# Altium project PUA.PrjPcb (part 13 of 14)

## Sheet Server_CPU_Sub_Power_Supplies.SchDoc
size D
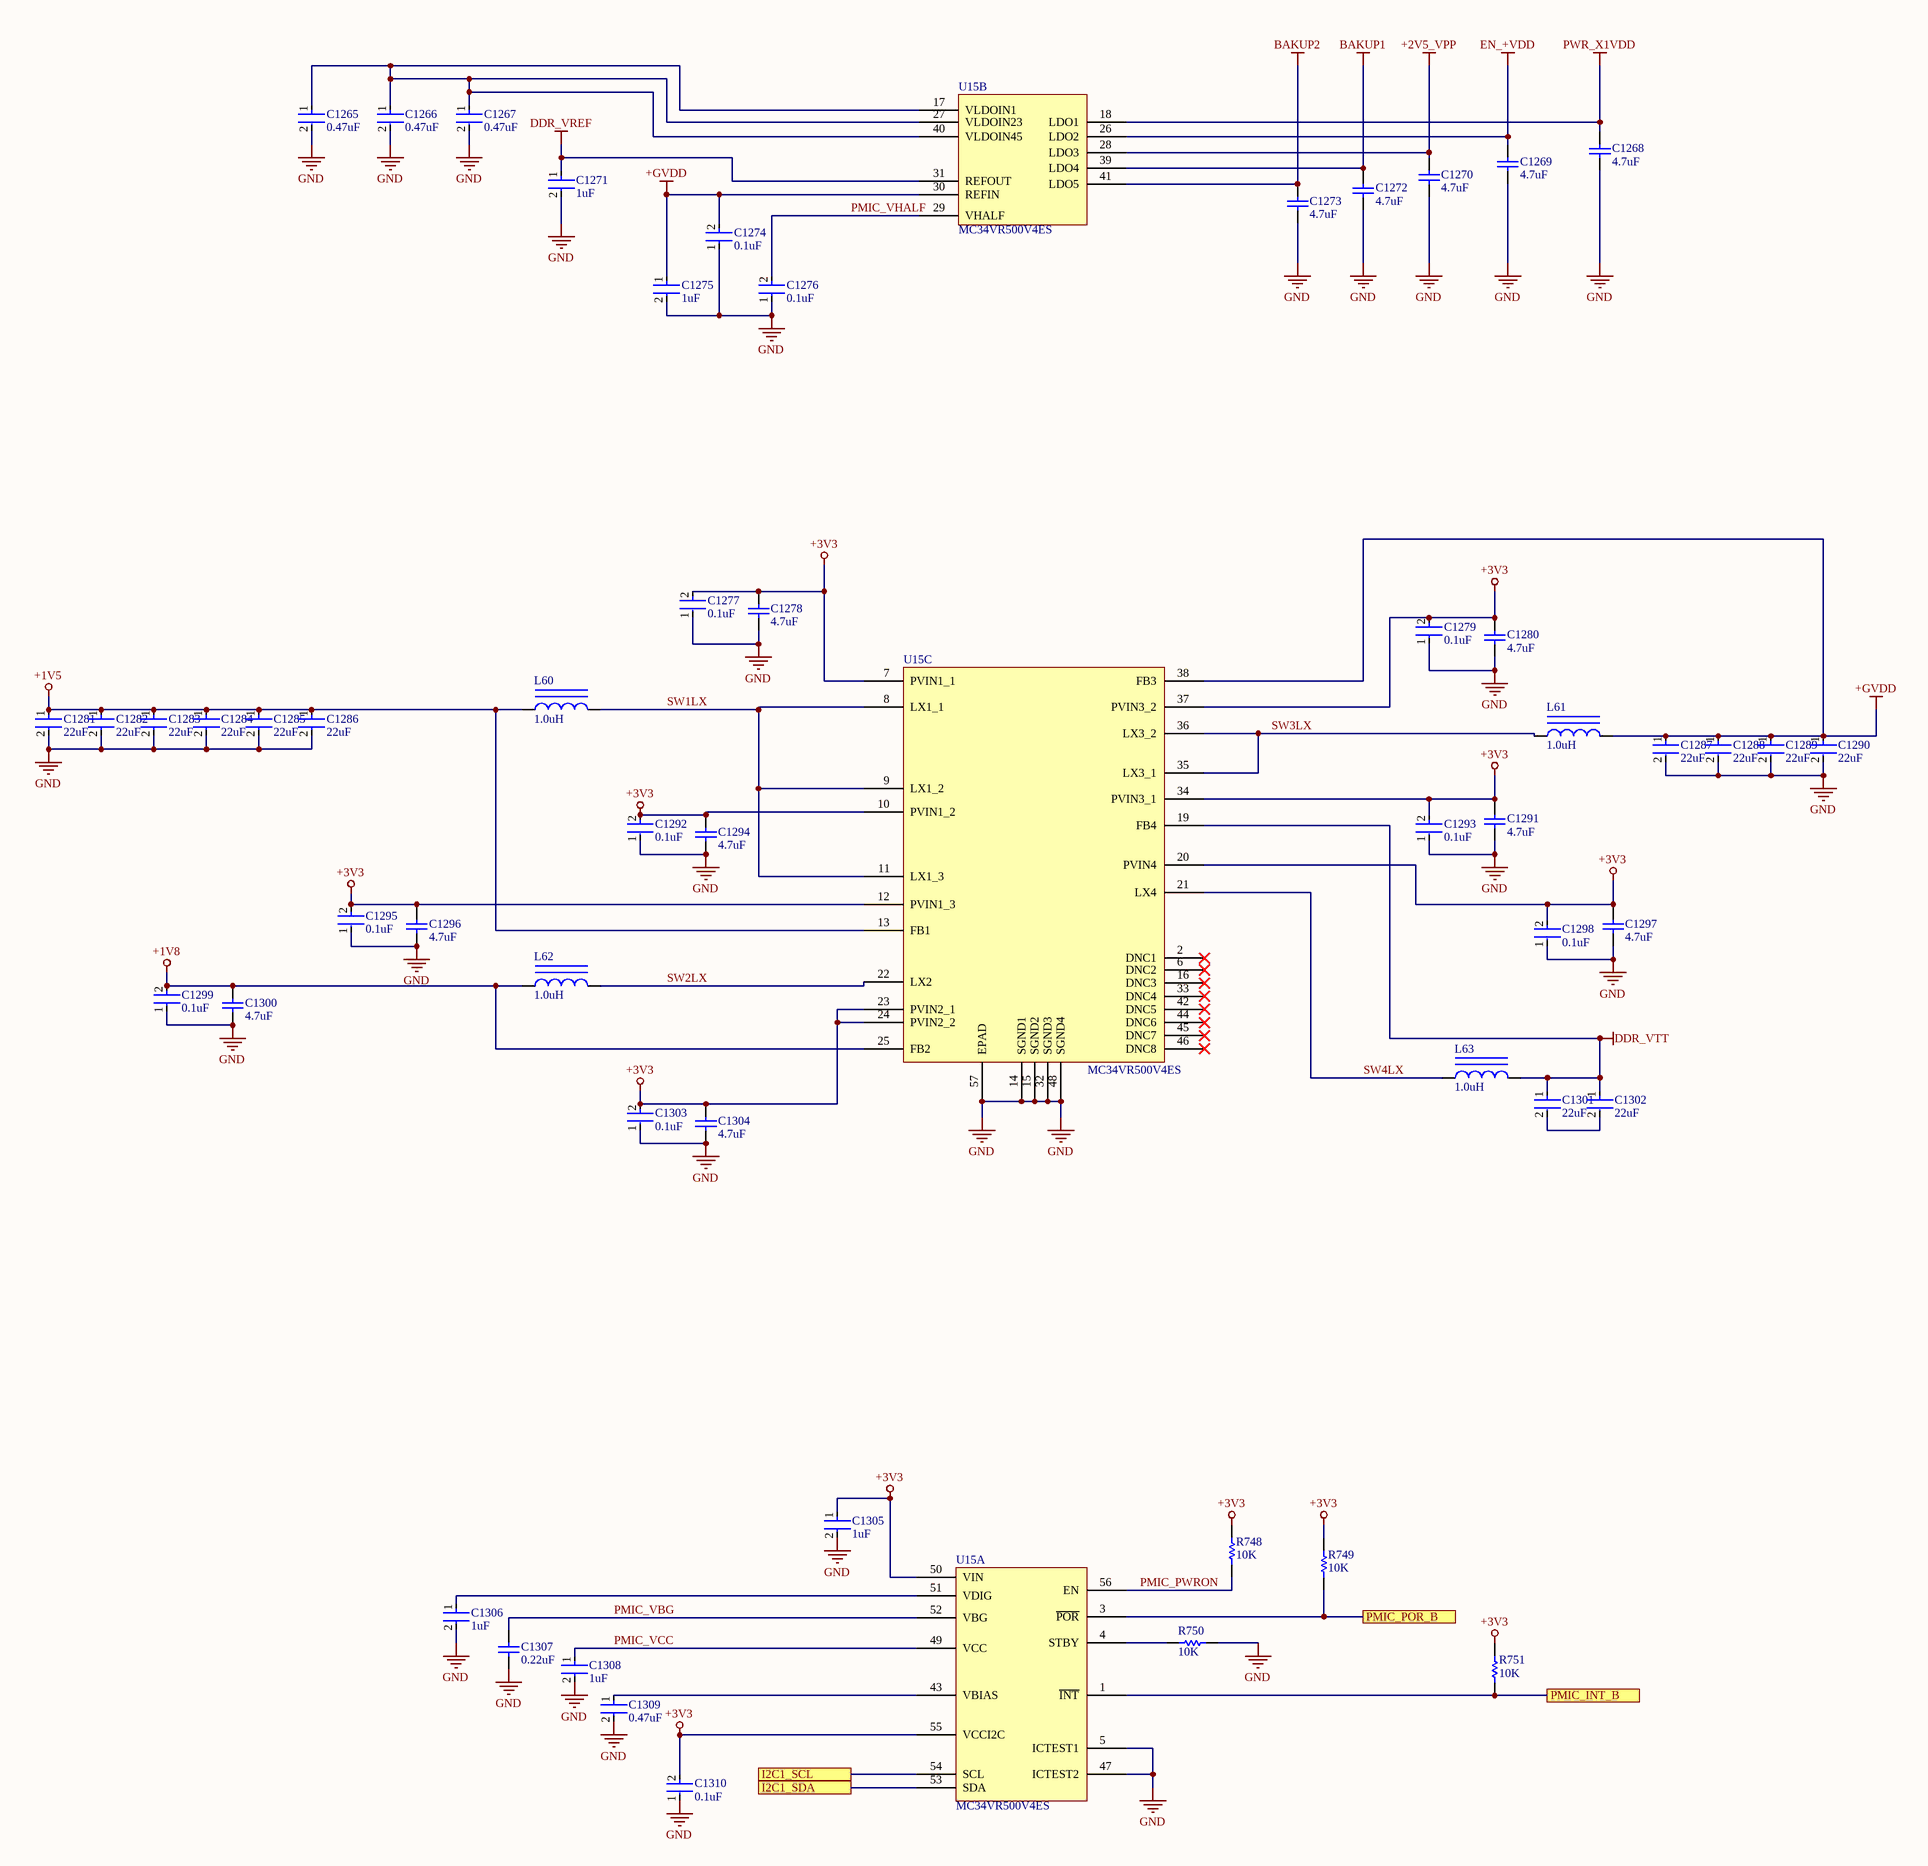
[diagram p64: Server_CPU_Sub_Power_Supplies.SchDoc]

### Parts
C1265  0.47uF  [FP-GRM188-0_1-e0_2_0_5-IPC_B]
C1266  0.47uF  [FP-GRM188-0_1-e0_2_0_5-IPC_B]
C1267  0.47uF  [FP-GRM188-0_1-e0_2_0_5-IPC_B]
C1268  4.7uF  [CAPC2013X145X50ML20T25]
C1269  4.7uF  [CAPC2013X145X50ML20T25]
C1270  4.7uF  [CAPC2013X145X50ML20T25]
C1271  1uF  [FP-GRM15-0_1-MFG]
C1272  4.7uF  [CAPC2013X145X50ML20T25]
C1273  4.7uF  [CAPC2013X145X50ML20T25]
C1274  0.1uF  [FP-GRM15-MFG]
C1275  1uF  [FP-GRM15-0_1-MFG]
C1276  0.1uF  [FP-GRM15-MFG]
C1277  0.1uF  [FP-GRM15-MFG]
C1278  4.7uF  [CAPC2013X145X50ML20T25]
C1279  0.1uF  [FP-GRM15-MFG]
C1280  4.7uF  [CAPC2013X145X50ML20T25]
C1281  22uF  [FP-GRM21B-0_15-MFG]
C1282  22uF  [FP-GRM21B-0_15-MFG]
C1283  22uF  [FP-GRM21B-0_15-MFG]
C1284  22uF  [FP-GRM21B-0_15-MFG]
C1285  22uF  [FP-GRM21B-0_15-MFG]
C1286  22uF  [FP-GRM21B-0_15-MFG]
C1287  22uF  [FP-GRM21B-0_15-MFG]
C1288  22uF  [FP-GRM21B-0_15-MFG]
C1289  22uF  [FP-GRM21B-0_15-MFG]
C1290  22uF  [FP-GRM21B-0_15-MFG]
C1291  4.7uF  [CAPC2013X145X50ML20T25]
C1292  0.1uF  [FP-GRM15-MFG]
C1293  0.1uF  [FP-GRM15-MFG]
C1294  4.7uF  [CAPC2013X145X50ML20T25]
C1295  0.1uF  [FP-GRM15-MFG]
C1296  4.7uF  [CAPC2013X145X50ML20T25]
C1297  4.7uF  [CAPC2013X145X50ML20T25]
C1298  0.1uF  [FP-GRM15-MFG]
C1299  0.1uF  [FP-GRM15-MFG]
C1300  4.7uF  [CAPC2013X145X50ML20T25]
C1301  22uF  [FP-GRM21B-0_15-MFG]
C1302  22uF  [FP-GRM21B-0_15-MFG]
C1303  0.1uF  [FP-GRM15-MFG]
C1304  4.7uF  [CAPC2013X145X50ML20T25]
C1305  1uF  [FP-GRM15-0_1-MFG]
C1306  1uF  [FP-GRM15-0_1-MFG]
C1307  0.22uF  [CAPC1005X55X25NL05T10]
C1308  1uF  [FP-GRM15-0_1-MFG]
C1309  0.47uF  [FP-GRM188-0_1-e0_2_0_5-IPC_B]
C1310  0.1uF  [FP-GRM15-MFG]
L60  1.0uH  [BOUR-CM45_L]
L61  1.0uH  [BOUR-CM45_L]
L62  1.0uH  [BOUR-CM45_L]
L63  1.0uH  [BOUR-CM45_L]
R748  10K  [RESC1005X40X25LL05T05]
R749  10K  [RESC1005X40X25LL05T05]
R750  10K  [RESC1005X40X25LL05T05]
R751  10K  [RESC1005X40X25LL05T05]
U15  MC34VR500V4ES  [QFN50P800X800X90-57N]  (parts A,B,C of 3)

### Ports
I2C1_SCL, I2C1_SDA, PMIC_INT_B, PMIC_POR_B

### Nets
+1V5: C1281.1 C1282.1 C1283.1 C1284.1 C1285.1 C1286.1 L60.1 U15.13(FB1)
+1V8: C1299.2 C1300.2 L62.1 U15.25(FB2)
+2V5_VPP: C1270.2 U15.28(LDO3)
+3V3: C1277.2 C1278.2 C1279.2 C1280.2 C1291.2 C1292.2 C1293.2 C1294.2 C1295.2 C1296.2 C1297.2 C1298.2 C1303.2 C1304.2 C1305.1 C1310.2 R748.2 R749.2 R751.2 U15.7(PVIN1_1) U15.10(PVIN1_2) U15.12(PVIN1_3) U15.20(PVIN4) U15.23(PVIN2_1) U15.24(PVIN2_2) U15.34(PVIN3_1) U15.37(PVIN3_2) U15.50(VIN) U15.55(VCCI2C)
+GVDD: C1274.2 C1275.1 C1287.1 C1288.1 C1289.1 C1290.1 L61.2 U15.30(REFIN) U15.38(FB3)
BAKUP1: C1272.2 U15.39(LDO4)
BAKUP2: C1273.2 U15.41(LDO5)
DDR_VREF: C1271.1 U15.31(REFOUT)
DDR_VTT: C1301.1 C1302.1 L63.2 U15.19(FB4)
EN_+VDD: C1269.2 U15.26(LDO2)
GND: C1265.2 C1266.2 C1267.2 C1268.1 C1269.1 C1270.1 C1271.2 C1272.1 C1273.1 C1274.1 C1275.2 C1276.1 C1277.1 C1278.1 C1279.1 C1280.1 C1281.2 C1282.2 C1283.2 C1284.2 C1285.2 C1286.2 C1287.2 C1288.2 C1289.2 C1290.2 C1291.1 C1292.1 C1293.1 C1294.1 C1295.1 C1296.1 C1297.1 C1298.1 C1299.1 C1300.1 C1303.1 C1304.1 C1305.2 C1306.2 C1307.1 C1308.2 C1309.2 C1310.1 R750.1 U15.5(ICTEST1) U15.14(SGND1) U15.15(SGND2) U15.32(SGND3) U15.47(ICTEST2) U15.48(SGND4) U15.57(EPAD)
PWR_X1VDD: C1268.2 U15.18(LDO1)
PMIC_PWRON: R748.1 U15.56(EN)
PMIC_VBG: C1307.2 U15.52(VBG)
PMIC_VCC: C1308.1 U15.49(VCC)
PMIC_VHALF: C1276.2 U15.29(VHALF)
SW1LX: L60.2 U15.8(LX1_1) U15.9(LX1_2) U15.11(LX1_3)
SW2LX: L62.2 U15.22(LX2)
SW3LX: L61.1 U15.35(LX3_1) U15.36(LX3_2)
SW4LX: L63.1 U15.21(LX4)
NetC1265_1: C1265.1 C1266.1 C1267.1 U15.17(VLDOIN1) U15.27(VLDOIN23) U15.40(VLDOIN45)
NetC1301_2: C1301.2 C1302.2
NetC1306_1: C1306.1 U15.51(VDIG)
NetC1309_1: C1309.1 U15.43(VBIAS)
NetR749_1: R749.1 U15.3(~{POR}) ; port PMIC_POR_B
NetR750_2: R750.2 U15.4(STBY)
NetR751_1: R751.1 U15.1(~{INT}) ; port PMIC_INT_B
NetU15_53: U15.53(SDA) ; port I2C1_SDA
NetU15_54: U15.54(SCL) ; port I2C1_SCL

Not connected (* = marked no-connect by the designer): U15 2(DNC1)* 6(DNC2)* 16(DNC3)* 33(DNC4)* 42(DNC5)* 44(DNC6)* 45(DNC7)* 46(DNC8)*

### Notes on the sheet
- Title
- Size:
- Date:
- File:
- D
- Number:
- Time:
- Revision:
- Sheet
- of

### Library data of the parts
C1265-C1267 C1309 = CMP-2006-02860-2: Chip Multilayer Ceramic Capacitors for General Purpose, 0603, 0.47uF, X7R, 15%, 10%, 16V; Capacitance: 470nF; Material: Ceramic; Termination: SMD/SMT; Case Code (Imperial): 0603; Height: 0.8mm; Dielectric: X7R; Length: 1.6mm; Packaging: Tape and Reel; Mount: Surface Mount; Thickness: 0.035inch; Voltage Rating (DC): 16V; Case Code (Metric): 1608; REACH SVHC: No SVHC; Depth: 0.8mm; Number of Pins: 2; Max Operating Temperature: 125°C; Min Operating Temperature: -55°C; Width: 0.8mm; Voltage: 16V; Lead Free: Lead Free; Voltage Rating: 16V; Package Quantity: 1; Case/Package: 0603; Tolerance: 10%
C1268-C1270 C1272 C1273 C1278 C1280 C1291 C1294 C1296 C1297 C1300 C1304 = CMP-2007-01010-1: Manufacturer: Kemet; Part Number: C0805C475K3PACTU
C1271 C1275 C1305 C1306 C1308 = CMP-2008-04556-2: CAP CER 1UF 10V X5R 0402; Manufacturer Part Number: GRM155R61A105KE15D; Manufacturer: Murata; Material: Ceramic; Tolerance: 10%; Temperature Coefficient: 15%; Octopart: https://octopart.com/grm155r61a105ke15d-murata-197442; Lead Free: Yes; ComponentLink2Description: Datasheet; Temperature: -55°C to +85°C; Temperature Range High: +85°C; Height: 0.55mm; Capacitance: 1uF; Ipc Land Pattern Name: CAPC10050X50; ComponentLink2URL: https://search.murata.co.jp/Ceramy/image/img/A01X/G101/ENG/GRM155R61A105KE15-01A.pdf; Temperature Range Low: -55°C; Device Class L2: Capacitors; Voltage Rating: 10V; RoHS: TRUE; Device Class L1: Passive Components; Device Class L3: Ceramic Capacitors; Temperature Characteristic: X5R; Mouser Description: 0402 1 uF 10 V ±10% Tolerance X5R Surface Mount Multilayer Ceramic Capacitor; Automotive: No; Package: GRM15-0.1; Digikey Description: CAP CER 1UF 10V X5R 0402; Value: 1uF; Category: Cap
C1274 C1276 C1277 C1279 C1292 C1293 C1295 C1298 C1299 C1303 C1310 = CMP-2100-03641-2: CAP CER 0.1UF 16V X7R 0402; Manufacturer Part Number: GRM155R71C104KA88D; Manufacturer: Murata; Standoff Height: 0mm; Tolerance: 10%; Voltage Rating: 16Vdc; Material: Ceramic; Capacitance: 0.10μF; Value: 0.10μF; RoHS: TRUE; Temperature Characteristic: X7R; Octopart: https://octopart.com/grm155r71c104ka88d-murata-196880; Digikey Description: CAP CER 0.1UF 16V X7R 0402; Device Class L3: Ceramic Capacitors; Height: 0.55mm; ComponentLink2Description: Datasheet; Temperature Range Low: -55°C; Ipc Land Pattern Name: CAPC10050X219; ComponentLink2URL: https://search.murata.co.jp/Ceramy/image/img/A01X/G101/ENG/GRM155R71H471KA01-01A.pdf; Device Class L1: Passive Components; Lead Free: yes; Category: Cap; Package: GRM15; Temperature: -55°C to +125°C; Device Class L2: Capacitors; Temperature Range High: +125°C; Mouser Description: 0402 0.1 uF 16V ±10 % Tolerance X7R SMT Multilayer Ceramic Capacitor
C1281-C1290 C1301 C1302 = CMP-2007-03385-2: Chip Multilayer Ceramic Capacitors for General Purpose, 0805, 22uF, X5R, 15%, 20%, 6.3V; Material: Ceramic; Max Operating Temperature: 85°C; Voltage: 6.3V; Min Operating Temperature: -55°C; Case/Package: 0805; Thickness: 0.053inch; Dielectric: X5R; Packaging: Tape and Reel; Depth: 1.25mm; Termination: SMD/SMT; Voltage Rating (DC): 6.3V; Radiation Hardening: No; Tolerance: 20%; Mount: Surface Mount; Lead Free: Lead Free; Package Quantity: 1; REACH SVHC: No SVHC; Voltage Rating: 6.3V; Capacitance: 22uF; Length: 2mm; Case Code (Imperial): 0805; Case Code (Metric): 2012; Width: 0.049inch; Height: 1.25mm
C1307 = CMP-2008-04561-4: Chip Capacitor, 220 nF, +/- 10%, 10 V, -55 to 85 degC, 0402 (1005 Metric), RoHS, Tape and Reel; Manufacturer: Basic Passives; PartNumber: GRM155R61A224KE19D; Case\/Package: 0402; Voltage Rating: 10 V; Type (Capacitors): X5R; Capacitance: 220 nF; Max Operating Temperature: 85 degC; Package Quantity: 1; RoHSCompliant: true; Height: 0.5 mm; Mounting Technology: Surface Mount; Case Code (Metric): 1005; ComponentLink2URL: http://search.murata.co.jp/Ceramy/image/img/A01X/G101/ENG/GRM155R61A224KE19-01.pdf; Case Code (Imperial): 0402; Length: 1 mm; Radiation Hardening: No; Tolerance: 10%; Pins: 2; ComponentLink1Description: Manufacturer URL; Voltage Rating (DC): 10 V; Width: 0.5 mm; REACH SVHC: No SVHC; ComponentLink1URL: http://www.murata.com/; Min Operating Temperature: -55 degC; DatasheetVersion: 03/2016; Mount: Surface Mount; PackageReference: 0402; Packaging: Tape and Reel; ComponentLink2Description: Datasheet; PackageDescription: 2-Pin Surface Mount Device, Body 1 x 0.5 mm
L60-L63 = CMP-2000-06114-1: Chip Inductor, 1 uH, +/- 10%, 450 mA, -40 to 125 degC, 2-Pin SMD (1812), RoHS, Tape and Reel; Manufacturer: Bourns; Nominal inductivity: 1µH; Content: 1pc(s); Nominal current: 0.45A; Type: CM453232-1R0KL; Category: Inductor; Package Description: 2-Pin Surface Mount Device, Body 4.5 x 3.2 mm; Manufacturer URL: http://www.bourns.com/; LN: 1µH; Package Reference: CM45; Mounting Technology: SurfaceMount; Datasheet URL: http://www.bourns.com/docs/Product-Datasheets/cm.pdf; Datasheet Version: 03/2016
R748-R751 = CMP-2000-07588-1: Chip Resistor, 10 KOhm, +/- 1%, 0.1 W, -55 to 155 degC, 0402 (1005 Metric), RoHS, Tape and Reel; Manufacturer: Panasonic; Power Rating: 100mW; Voltage Rating: 50V; Resistance: 10KOhm; Case\/Package: 0402; Temperature Coefficient: 100ppm\/degreesC; RoHSCompliant: True; Lead Free: LeadFree; Package Quantity: 1; Contact Plating: Tin; Length: 1mm; Radiation Hardening: No; REACH SVHC: NoSVHC; Max Operating Temperature: 155degC; Depth: 0.5mm; Case Code (Imperial): 0402; Military Standard: Not; Package Description: 2-Pin Surface Mount Device, Body 1 x 0.5 mm; Termination: SMD/SMT; Case Code (Metric): 1005; Height: 0.35mm; Packaging: TapeandReel; Voltage Rating (DC): 50V; Package Reference: 402; Number of Pins: 2; Tolerance: 1%; Mounting Technology: SurfaceMount; Width: 0.02inch; Mount: SurfaceMount; Datasheet URL: https://industrial.panasonic.com/cdbs/www-data/pdf/RDA0000/AOA0000C304.pdf; Composition: ThickFilm; Datasheet Version: 02/2017; Manufacturer URL: http://www.panasonic.com/; Max Power Dissipation: 100mW; Number of Terminations: 2; Min Operating Temperature: -55degC
U15 = MC34VR500V4ES: Regulator, Buck, Quad with up to 4.5A Output and Triple User-programmable LDOs, QFN 56, Tray; MF: {'manufacturer': u'NXP Semiconductors'}; Package: None; MP: MC34VR500V4ES; Value: *; Availability: Unavailable; Price: None

## Sheet SGMII_CONNECTION.SchDoc
size A
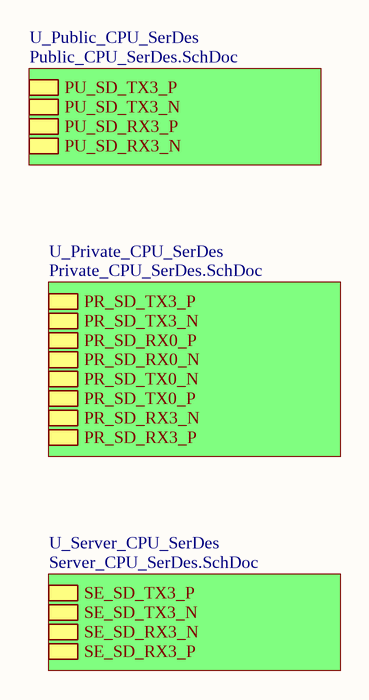
[diagram p65: SGMII_CONNECTION.SchDoc]

### Sub-sheets
U_Private_CPU_SerDes = Private_CPU_SerDes.SchDoc: PR_SD_TX3_P, PR_SD_TX3_N, PR_SD_RX0_P, PR_SD_RX0_N, PR_SD_TX0_N, PR_SD_TX0_P, PR_SD_RX3_N, PR_SD_RX3_P
U_Public_CPU_SerDes = Public_CPU_SerDes.SchDoc: PU_SD_TX3_P, PU_SD_TX3_N, PU_SD_RX3_P, PU_SD_RX3_N
U_Server_CPU_SerDes = Server_CPU_SerDes.SchDoc: SE_SD_TX3_P, SE_SD_TX3_N, SE_SD_RX3_N, SE_SD_RX3_P

## Sheet Public_CPU_SerDes.SchDoc
size D
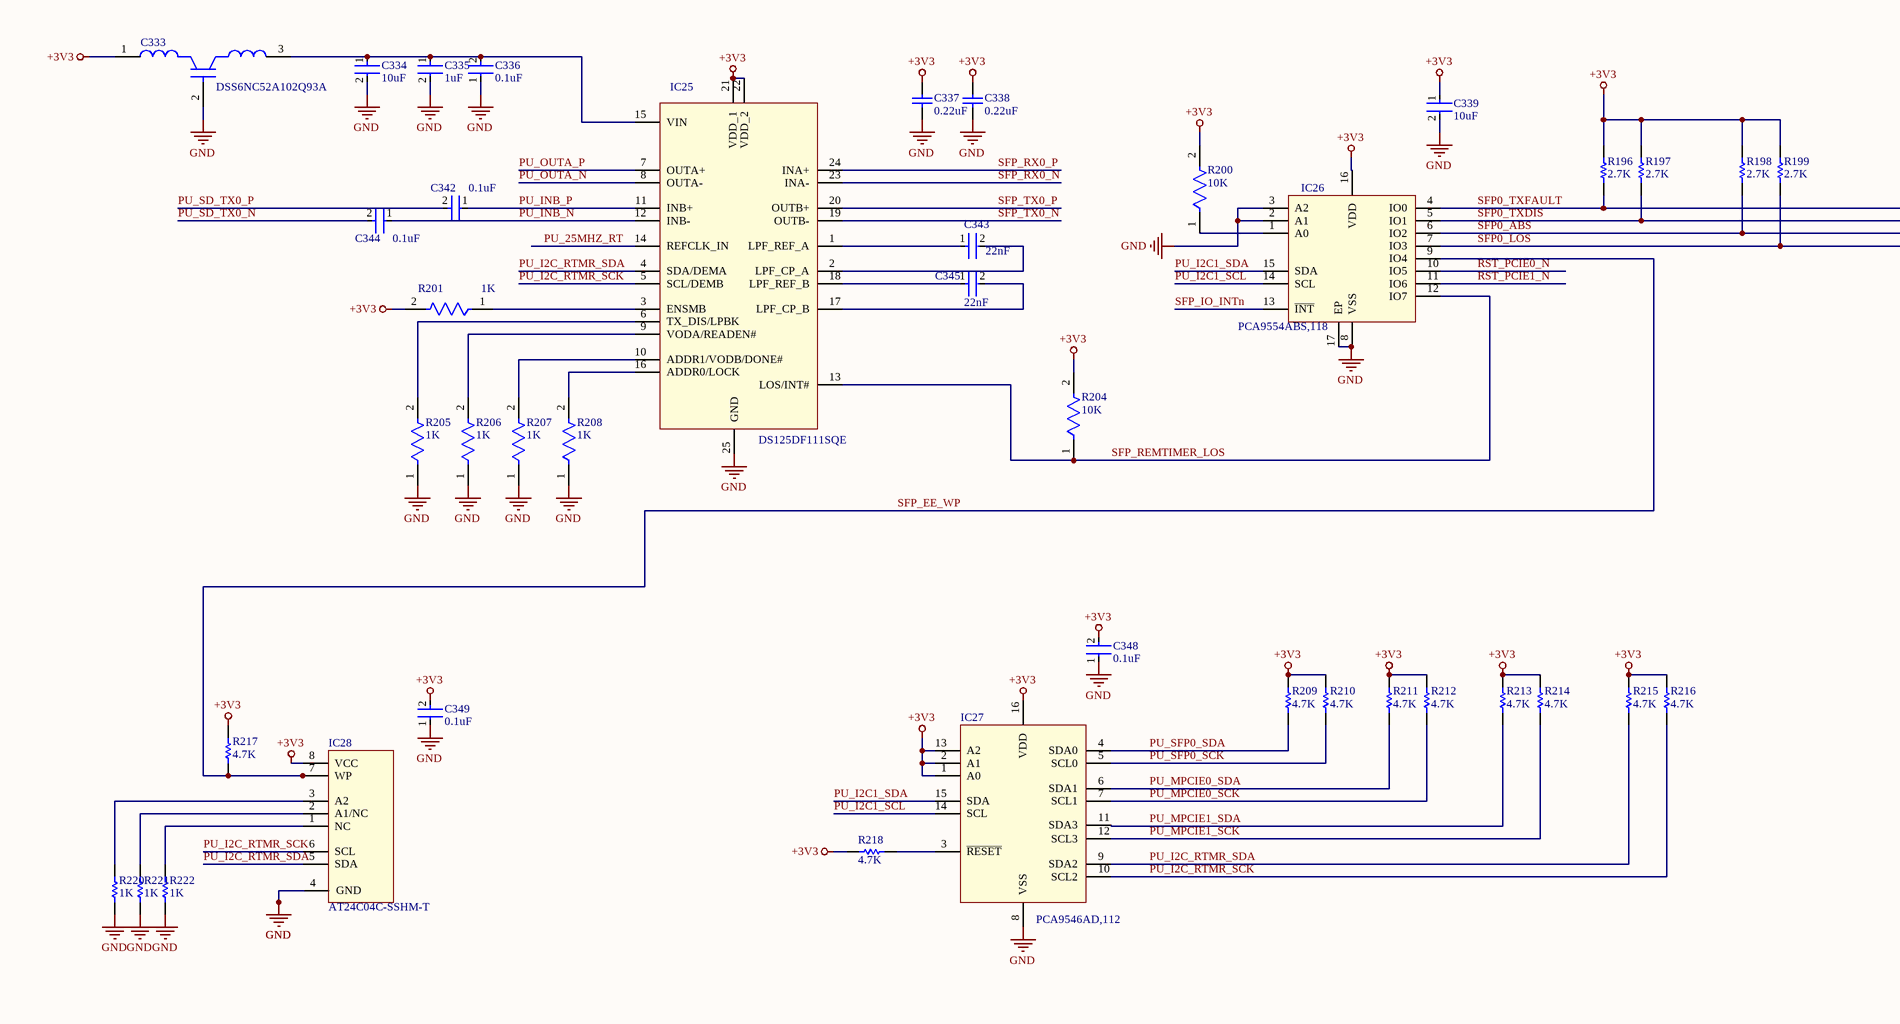
[diagram p66: Public_CPU_SerDes.SchDoc, top left]
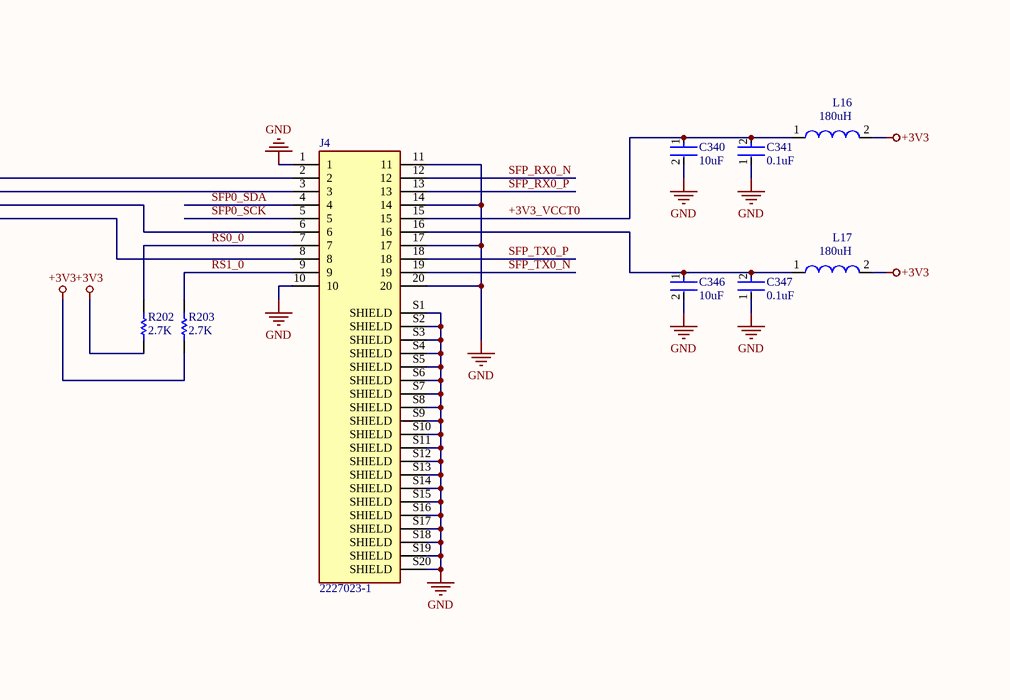
[diagram p67: Public_CPU_SerDes.SchDoc, top right]
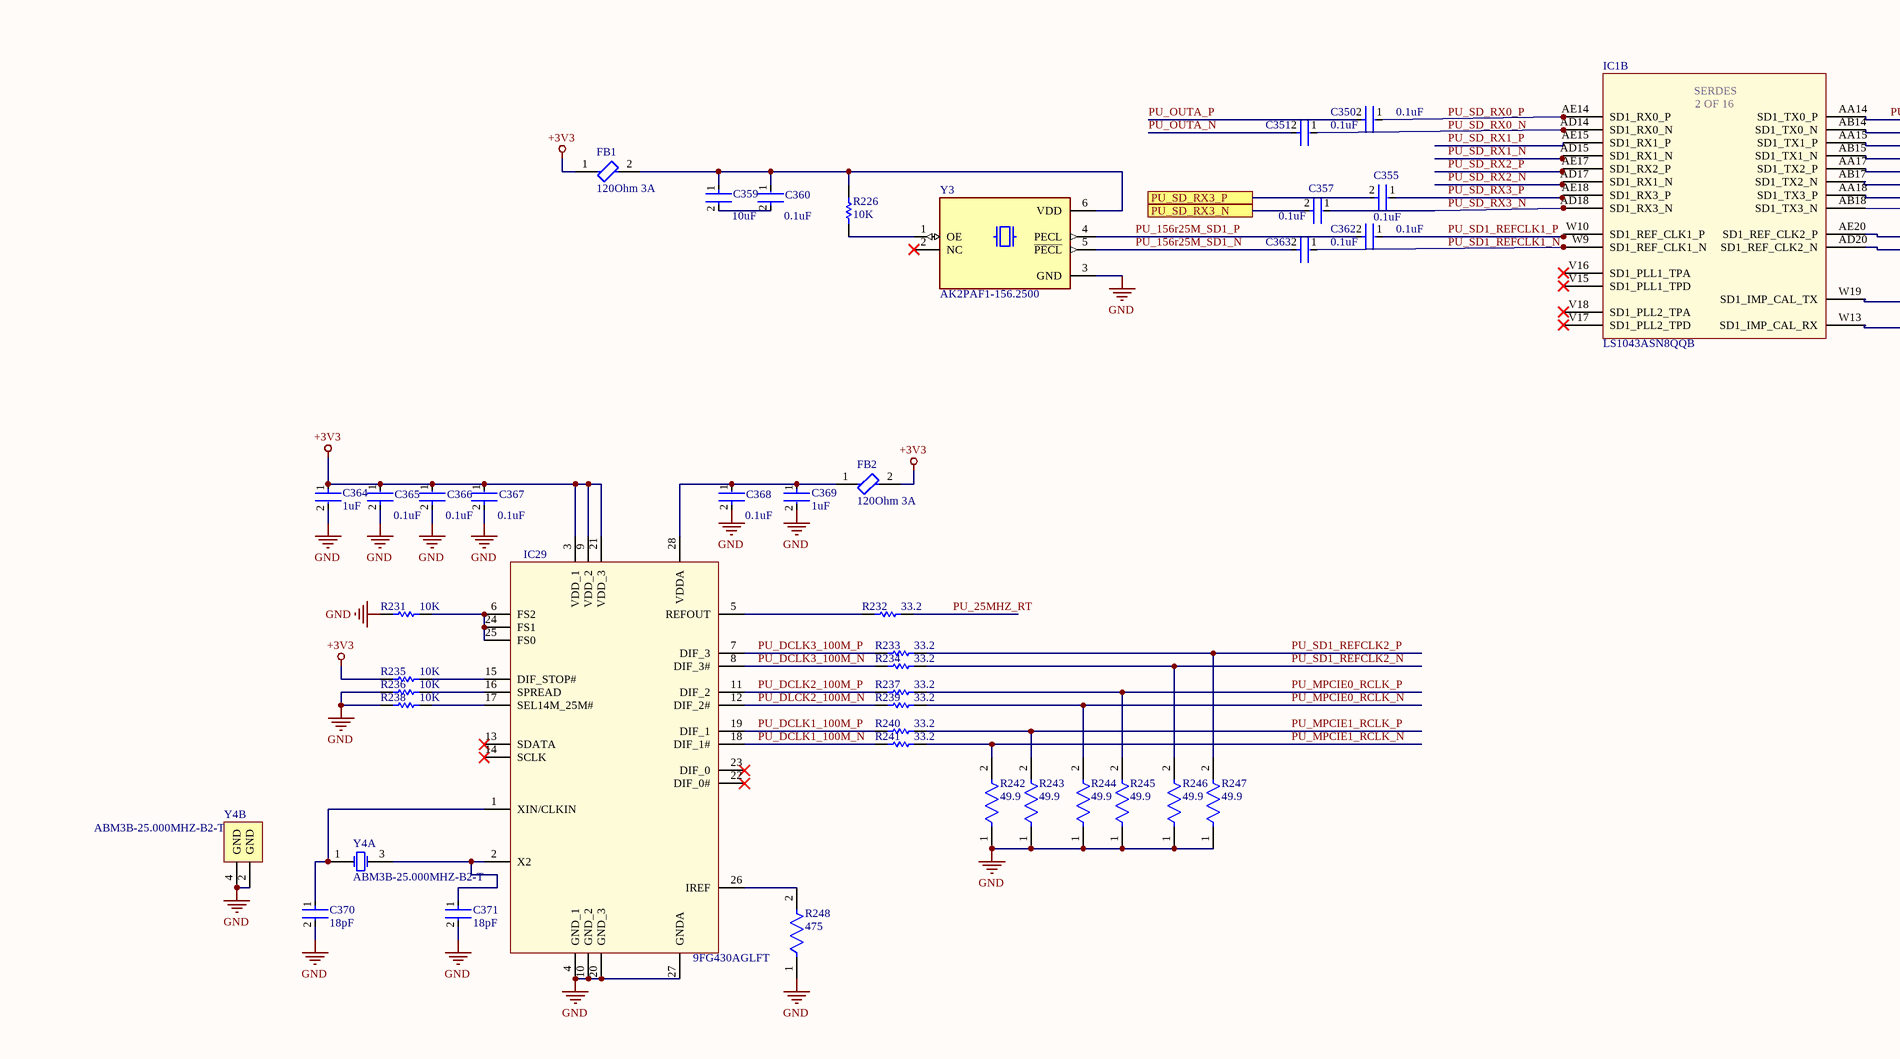
[diagram p68: Public_CPU_SerDes.SchDoc, bottom left]
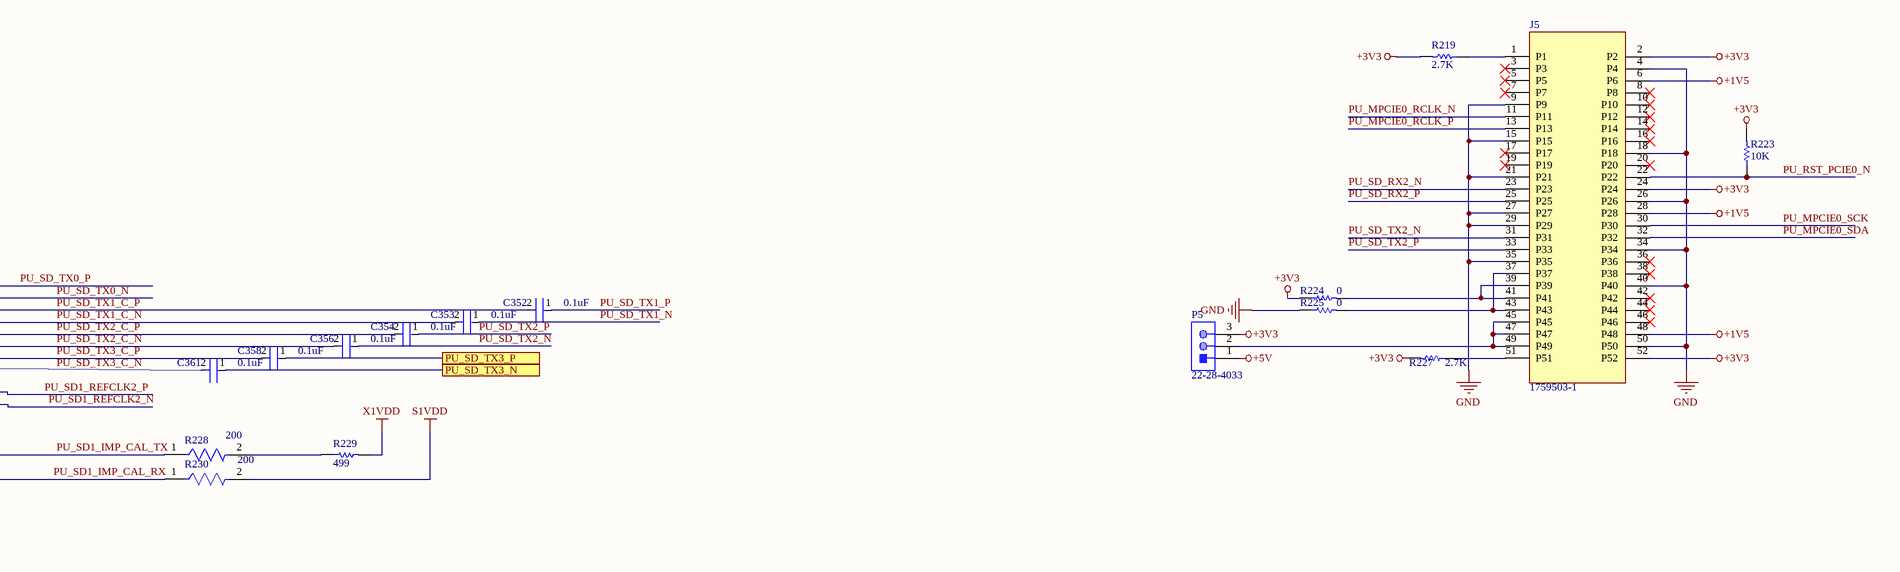
[diagram p69: Public_CPU_SerDes.SchDoc, bottom right]

### Parts
C333  DSS6NC52A102Q93A  [FP-DSS6N_Q-MFG]
C334  10uF  [FP-C0805C-DG-MFG]
C335  1uF  [FP-GRM15-0_1-MFG]
C336  0.1uF  [FP-GRM15-MFG]
C337  0.22uF  [CAPC1005X55X25NL05T10]
C338  0.22uF  [CAPC1005X55X25NL05T10]
C339  10uF  [FP-C0805C-DG-MFG]
C340  10uF  [FP-C0805C-DG-MFG]
C341  0.1uF  [FP-GRM15-MFG]
C342  0.1uF  [FP-GRM15-MFG]
C343  22nF  [FP-GRM155-0_05-IPC_C]
C344  0.1uF  [FP-GRM15-MFG]
C345  22nF  [FP-GRM155-0_05-IPC_C]
C346  10uF  [FP-C0805C-DG-MFG]
C347  0.1uF  [FP-GRM15-MFG]
C348  0.1uF  [FP-GRM15-MFG]
C349  0.1uF  [FP-GRM15-MFG]
C350  0.1uF  [FP-GRM15-MFG]
C351  0.1uF  [FP-GRM15-MFG]
C352  0.1uF  [FP-GRM15-MFG]
C353  0.1uF  [FP-GRM15-MFG]
C354  0.1uF  [FP-GRM15-MFG]
C355  0.1uF  [FP-GRM15-MFG]
C356  0.1uF  [FP-GRM15-MFG]
C357  0.1uF  [FP-GRM15-MFG]
C358  0.1uF  [FP-GRM15-MFG]
C359  10uF  [FP-C0805C-DG-MFG]
C360  0.1uF  [FP-GRM15-MFG]
C361  0.1uF  [FP-GRM15-MFG]
C362  0.1uF  [FP-GRM15-MFG]
C363  0.1uF  [FP-GRM15-MFG]
C364  1uF  [FP-GRM15-0_1-MFG]
C365  0.1uF  [FP-GRM15-MFG]
C366  0.1uF  [FP-GRM15-MFG]
C367  0.1uF  [FP-GRM15-MFG]
C368  0.1uF  [FP-GRM15-MFG]
C369  1uF  [FP-GRM15-0_1-MFG]
C370  18pF  [FP-C0402-BB-MFG]
C371  18pF  [FP-C0402-BB-MFG]
FB1  120Ohm 3A  [FP-BLM18-0_15-t0_5-d1_2-MFG]
FB2  120Ohm 3A  [FP-BLM18-0_15-t0_5-d1_2-MFG]
IC1  LS1043ASN8QQB  [BGA780C80P28X28_2300X2300X261]  (part B of 16)
IC25  DS125DF111SQE  [QFN50P400X400X80-25N]
IC26  PCA9554ABS,118  [QFN65P400X400X100-17N-D]
IC27  PCA9546AD,112  [SOIC127P600X175-16N]
IC28  AT24C04C-SSHM-T  [SOIC127P600X175-8N]
IC29  9FG430AGLFT  [SOP65P640X120-28N]
J4  2227023-1  [TE_2227023-1]
J5  1759503-1  [TE_1759503-1]
L16  180uH  [WE-PD2-L]
L17  180uH  [WE-PD2-L]
P5  22-28-4033  [MOLX-22-28-4033_V]
R196  2.7K  [RESC1005X40X25NL05T05]
R197  2.7K  [RESC1005X40X25NL05T05]
R198  2.7K  [RESC1005X40X25NL05T05]
R199  2.7K  [RESC1005X40X25NL05T05]
R200  10K  [FP-CRCW0402-e3-MFG]
R201  1K  [FP-CRCW0402-e3-MFG]
R202  2.7K  [RESC1005X40X25NL05T05]
R203  2.7K  [RESC1005X40X25NL05T05]
R204  10K  [FP-CRCW0402-e3-MFG]
R205  1K  [FP-CRCW0402-e3-MFG]
R206  1K  [FP-CRCW0402-e3-MFG]
R207  1K  [FP-CRCW0402-e3-MFG]
R208  1K  [FP-CRCW0402-e3-MFG]
R209  4.7K  [RESC1005X40X25LL05T05]
R210  4.7K  [RESC1005X40X25LL05T05]
R211  4.7K  [RESC1005X40X25LL05T05]
R212  4.7K  [RESC1005X40X25LL05T05]
R213  4.7K  [RESC1005X40X25LL05T05]
R214  4.7K  [RESC1005X40X25LL05T05]
R215  4.7K  [RESC1005X40X25LL05T05]
R216  4.7K  [RESC1005X40X25LL05T05]
R217  4.7K  [RESC1005X40X25LL05T05]
R218  4.7K  [RESC1005X40X25LL05T05]
R219  2.7K  [RESC1005X40X25NL05T05]
R220  1K  [RESC1005X40X25NL05T05]
R221  1K  [RESC1005X40X25NL05T05]
R222  1K  [RESC1005X40X25NL05T05]
R223  10K  [RESC1005X40X25LL05T05]
R224  0  [RESC2013X50X30LL20T20]
R225  0  [RESC2013X50X30LL20T20]
R226  10K  [RESC1005X40X25LL05T05]
R227  2.7K  [RESC1005X40X25NL05T05]
R228  200  [FP-CRCW0402-e3-IPC_C]
R229  499  [RESC1005X40X25LL05T05]
R230  200  [FP-CRCW0402-e3-IPC_C]
R231  10K  [RESC1005X40X25LL05T05]
R232  33.2  [RESC1005X40X25LL05T05]
R233  33.2  [RESC1005X40X25LL05T05]
R234  33.2  [RESC1005X40X25LL05T05]
R235  10K  [RESC1005X40X25LL05T05]
R236  10K  [RESC1005X40X25LL05T05]
R237  33.2  [RESC1005X40X25LL05T05]
R238  10K  [RESC1005X40X25LL05T05]
R239  33.2  [RESC1005X40X25LL05T05]
R240  33.2  [RESC1005X40X25LL05T05]
R241  33.2  [RESC1005X40X25LL05T05]
R242  49.9  [FP-CRCW0402-e3-MFG]
R243  49.9  [FP-CRCW0402-e3-MFG]
R244  49.9  [FP-CRCW0402-e3-MFG]
R245  49.9  [FP-CRCW0402-e3-MFG]
R246  49.9  [FP-CRCW0402-e3-MFG]
R247  49.9  [FP-CRCW0402-e3-MFG]
R248  475  [FP-CRCW0603-e3-IPC_C]
Y3  AK2PAF1-156.2500  [XTAL_AK2PAF1-156.2500]
Y4  ABM3B-25.000MHZ-B2-T  [ABRA-ABM3B-4_V]  (parts A,B of 2)

### Ports
PU_SD_RX3_N, PU_SD_RX3_P, PU_SD_TX3_N, PU_SD_TX3_P

### Nets
+1V5: J5.6(P6) J5.28(P28) J5.48(P48)
+3V3: C333.1 C337.2 C338.2 C339.1 C348.2 C349.2 C364.1 C365.1 C366.1 C367.1 FB1.1 FB2.2 IC25.21(VDD_1) IC25.22(VDD_2) IC26.16(VDD) IC27.1(A0) IC27.2(A1) IC27.13(A2) IC27.16(VDD) IC28.8(VCC) IC29.3(VDD_1) IC29.9(VDD_2) IC29.21(VDD_3) J5.2(P2) J5.24(P24) J5.52(P52) L16.2 L17.2 P5.3 R196.2 R197.2 R198.2 R199.2 R200.2 R201.2 R202.1 R203.1 R204.2 R209.2 R210.2 R211.2 R212.2 R213.2 R214.2 R215.2 R216.2 R217.2 R218.2 R219.2 R223.2 R224.1 R227.2 R235.2
+5V: P5.1
GND: C333.2(GND) C334.2 C335.2 C336.1 C337.1 C338.1 C339.2 C340.2 C341.1 C346.2 C347.1 C348.1 C349.1 C364.2 C365.2 C366.2 C367.2 C368.2 C369.2 C370.2 C371.2 IC25.25(GND) IC26.2(A1) IC26.3(A2) IC26.8(VSS) IC26.17(EP) IC27.8(VSS) IC28.4(GND) IC29.4(GND_1) IC29.10(GND_2) IC29.20(GND_3) IC29.27(GNDA) J4.1 J4.10 J4.11 J4.14 J4.17 J4.20 J4.S1(SHIELD) J4.S2(SHIELD) J4.S3(SHIELD) J4.S4(SHIELD) J4.S5(SHIELD) J4.S6(SHIELD) J4.S7(SHIELD) J4.S8(SHIELD) J4.S9(SHIELD) J4.S10(SHIELD) J4.S11(SHIELD) J4.S12(SHIELD) J4.S13(SHIELD) J4.S14(SHIELD) J4.S15(SHIELD) J4.S16(SHIELD) J4.S17(SHIELD) J4.S18(SHIELD) J4.S19(SHIELD) J4.S20(SHIELD) J5.4(P4) J5.9(P9) J5.15(P15) J5.18(P18) J5.21(P21) J5.26(P26) J5.27(P27) J5.29(P29) J5.34(P34) J5.35(P35) J5.40(P40) J5.50(P50) R205.1 R206.1 R207.1 R208.1 R220.1 R221.1 R222.1 R225.1 R231.2 R236.2 R238.2 R242.1 R243.1 R244.1 R245.1 R246.1 R247.1 R248.1 Y3.3(GND) Y4.2(GND) Y4.4(GND)
S1VDD: R230.2
X1VDD: R229.2
+3V3_VCCT0: C340.1 C341.2 J4.15 L16.1
PU_25MHZ_RT: IC25.14(REFCLK_IN) R232.2
PU_156r25M_SD1_N: C363.2 Y3.5(~{PECL})
PU_156r25M_SD1_P: C362.2 Y3.4(PECL)
PU_DCLK1_100M_N: IC29.18(DIF_1#) R241.1
PU_DCLK1_100M_P: IC29.19(DIF_1) R240.1
PU_DCLK2_100M_P: IC29.11(DIF_2) R237.1
PU_DCLK3_100M_N: IC29.8(DIF_3#) R234.1
PU_DCLK3_100M_P: IC29.7(DIF_3) R233.1
PU_DLCK2_100M_N: IC29.12(DIF_2#) R239.1
PU_I2C1_SCL: IC26.14(SCL) IC27.14(SCL)
PU_I2C1_SDA: IC26.15(SDA) IC27.15(SDA)
PU_I2C_RTMR_SCK: IC25.5(SCL/DEMB) IC27.10(SCL2) IC28.6(SCL) R216.1
PU_I2C_RTMR_SDA: IC25.4(SDA/DEMA) IC27.9(SDA2) IC28.5(SDA) R215.1
PU_INB_N: C344.1 IC25.12(INB-)
PU_INB_P: C342.1 IC25.11(INB+)
PU_MPCIE0_RCLK_N: J5.11(P11) R239.2 R244.2
PU_MPCIE0_RCLK_P: J5.13(P13) R237.2 R245.2
PU_MPCIE0_SCK: IC27.7(SCL1) J5.30(P30) R212.1
PU_MPCIE0_SDA: IC27.6(SDA1) J5.32(P32) R211.1
PU_MPCIE1_RCLK_N: R241.2 R242.2
PU_MPCIE1_RCLK_P: R240.2 R243.2
PU_MPCIE1_SCK: IC27.12(SCL3) R214.1
PU_MPCIE1_SDA: IC27.11(SDA3) R213.1
PU_OUTA_N: C351.2 IC25.8(OUTA-)
PU_OUTA_P: C350.2 IC25.7(OUTA+)
PU_RST_PCIE0_N: J5.22(P22) R223.1
PU_SD1_IMP_CAL_RX: IC1.W13(SD1_IMP_CAL_RX) R230.1
PU_SD1_IMP_CAL_TX: IC1.W19(SD1_IMP_CAL_TX) R228.1
PU_SD1_REFCLK1_P: C362.1 IC1.W10(SD1_REF_CLK1_P)
PU_SD1_REFCLK2_N: IC1.AD20(SD1_REF_CLK2_N) R234.2 R246.2
PU_SD1_REFCLK2_P: IC1.AE20(SD1_REF_CLK2_P) R233.2 R247.2
PU_SD_RX1_N: IC1.AD15(SD1_RX1_N)
PU_SD_RX1_P: IC1.AE15(SD1_RX1_P)
PU_SD_RX2_N: IC1.AD17(SD1_RX1_N) J5.23(P23)
PU_SD_RX2_P: IC1.AE17(SD1_RX2_P) J5.25(P25)
PU_SD_RX3_N: C357.1 IC1.AD18(SD1_RX3_N)
PU_SD_RX3_P: C355.1 IC1.AE18(SD1_RX3_P)
PU_SD_TX0_N: C344.2 IC1.AB14(SD1_TX0_N)
PU_SD_TX0_P: C342.2 IC1.AA14(SD1_TX0_P)
PU_SD_TX1_C_N: C353.2 IC1.AB15(SD1_TX1_N)
PU_SD_TX1_C_P: C352.2 IC1.AA15(SD1_TX1_P)
PU_SD_TX1_N: C353.1
PU_SD_TX1_P: C352.1
PU_SD_TX2_C_N: C356.2 IC1.AB17(SD1_TX2_N)
PU_SD_TX2_C_P: C354.2 IC1.AA17(SD1_TX2_P)
PU_SD_TX2_N: C356.1 J5.31(P31)
PU_SD_TX2_P: C354.1 J5.33(P33)
PU_SD_TX3_C_P: C358.2 IC1.AA18(SD1_TX3_P)
PU_SFP0_SCK: IC27.5(SCL0) R210.1
PU_SFP0_SDA: IC27.4(SDA0) R209.1
RS0_0: J4.7 R202.2
RS1_0: J4.9 R203.2
RST_PCIE0_N: IC26.10(IO5)
RST_PCIE1_N: IC26.11(IO6)
SFP0_ABS: IC26.6(IO2) J4.6 R198.1
SFP0_LOS: IC26.7(IO3) J4.8 R199.1
SFP0_SCK: J4.5
SFP0_SDA: J4.4
SFP0_TXDIS: IC26.5(IO1) J4.3 R197.1
SFP0_TXFAULT: IC26.4(IO0) J4.2 R196.1
SFP_EE_WP: IC26.9(IO4) IC28.7(WP) R217.1
SFP_IO_INTn: IC26.13(~{INT})
SFP_REMTIMER_LOS: IC25.13(LOS/INT#) IC26.12(IO7) R204.1
SFP_RX0_N: IC25.23(INA-) J4.12
SFP_RX0_P: IC25.24(INA+) J4.13
SFP_TX0_N: IC25.19(OUTB-) J4.19
SFP_TX0_P: IC25.20(OUTB+) J4.18
NetC333_3: C333.3 C334.1 C335.1 C336.2 IC25.15(VIN)
NetC343_1: C343.1 IC25.1(LPF_REF_A)
NetC343_2: C343.2 IC25.2(LPF_CP_A)
NetC345_1: C345.1 IC25.18(LPF_REF_B)
NetC345_2: C345.2 IC25.17(LPF_CP_B)
NetC346_1: C346.1 C347.2 J4.16 L17.1
NetC350_1: C350.1 IC1.AE14(SD1_RX0_P)
NetC351_1: C351.1 IC1.AD14(SD1_RX0_N)
NetC355_2: C355.2 ; port PU_SD_RX3_P
NetC357_2: C357.2 ; port PU_SD_RX3_N
NetC358_1: C358.1 ; port PU_SD_TX3_P
NetC359_1: C359.1 C360.1 FB1.2 R226.2 Y3.6(VDD)
NetC359_2: C359.2 C360.2
NetC361_1: C361.1 ; port PU_SD_TX3_N
NetC361_2: C361.2 IC1.AB18(SD1_TX3_N)
NetC363_1: C363.1 IC1.W9(SD1_REF_CLK1_N)
NetC368_1: C368.1 C369.1 FB2.1 IC29.28(VDDA)
NetC370_1: C370.1 IC29.1(XIN/CLKIN) Y4.1(X1)
NetC371_1: C371.1 IC29.2(X2) Y4.3(X2)
NetIC25_3: IC25.3(ENSMB) R201.1
NetIC25_6: IC25.6(TX_DIS/LPBK) R205.2
NetIC25_9: IC25.9(VODA/READEN#) R206.2
NetIC25_10: IC25.10(ADDR1/VODB/DONE#) R207.2
NetIC25_16: IC25.16(ADDR0/LOCK) R208.2
NetIC26_1: IC26.1(A0) R200.1
NetIC27_3: IC27.3(~{RESET}) R218.1
NetIC28_1: IC28.1(NC) R222.2
NetIC28_2: IC28.2(A1/NC) R221.2
NetIC28_3: IC28.3(A2) R220.2
NetIC29_5: IC29.5(REFOUT) R232.1
NetIC29_6: IC29.6(FS2) IC29.24(FS1) IC29.25(FS0) R231.1
NetIC29_15: IC29.15(DIF_STOP#) R235.1
NetIC29_16: IC29.16(SPREAD) R236.1
NetIC29_17: IC29.17(SEL14M_25M#) R238.1
NetIC29_26: IC29.26(IREF) R248.2
NetJ5_1: J5.1(P1) R219.1
NetJ5_37: J5.37(P37) J5.43(P43) R225.2
NetJ5_39: J5.39(P39) J5.41(P41) R224.2
NetJ5_45: J5.45(P45) J5.47(P47) J5.49(P49) P5.2
NetJ5_51: J5.51(P51) R227.1
NetR226_1: R226.1 Y3.1(OE)
NetR228_2: R228.2 R229.1

Not connected (* = marked no-connect by the designer): IC1 V15(SD1_PLL1_TPD)* V16(SD1_PLL1_TPA)* V17(SD1_PLL2_TPD)* V18(SD1_PLL2_TPA)*; IC29 13(SDATA)* 14(SCLK)* 22(DIF_0#)* 23(DIF_0)*; J5 3(P3)* 5(P5)* 7(P7)* 8(P8)* 10(P10)* 12(P12)* 14(P14)* 16(P16)* 17(P17)* 19(P19)* 20(P20)* 36(P36)* 38(P38)* 42(P42)* 44(P44)* 46(P46)*; Y3 2(NC)*

### Notes on the sheet
- Labels drawn without touching a wire or pin: PU_SD1_REFCLK1_N, PU_SD_RX0_N, PU_SD_RX0_P, PU_SD_TX3_C_N
- Title
- Size:
- Date:
- File:
- D
- Number:
- Time:
- Revision:
- Sheet
- of
- (in symbol LS1043ASN8QQB, part B) SERDES; 2 OF 16

### Library data of the parts
C333 = CMP-06053-000338-1: Leaded 3 Terminal Capacitors 1000pF ±20% 100Vdc 6A; Capacitance: 1nF; Voltage Rating (DC): 100V; Ripple Current: 7A; Lead Free: Lead Free; Length: 8mm; Mount: Through Hole; Current Rating: 6A; Min Operating Temperature: -25°C; Width: 2.54mm; Termination: Radial; Max DC Current: 6A; Height: 10mm; Tolerance: 20%; Max Voltage Rating (DC): 100V; Package Quantity: 2000; Max Operating Temperature: 85°C; Radiation Hardening: No; Depth: 2.54mm; Packaging: Tape and Reel; Case/Package: Radial; Max Current Rating: 6A
C334 C339 C340 C346 C359 = CMP-2007-03243-2: CAP CER 10UF 10V X5R 0805; Manufacturer Part Number: C0805C106K8PACTU; Manufacturer: Kemet; 3DS Part Number: 220-00001; Tolerance: 10%; Temperature Coefficient: 15%; Material: Ceramic; Device Class L2: Capacitors; Device Class L1: Passive Components; ComponentLink2URL: https://content.kemet.com/datasheets/KEM_C1006_X5R_SMD.pdf; Height: 1.4mm; Lead Free: Yes; Digikey Description: CAP CER 10UF 10V X5R 0805; Octopart: https://octopart.com/c0805c106k8pactu-kemet-98697; Capacitance: 10uF; Value: 10uF; Temperature Range Low: -55°C; Temperature: -55°C to +85°C; Automotive: No; Mouser Description: CAP CER 10UF 10V X5R 0805; Ipc Land Pattern Name: CAPC200125X125; Temperature Range High: +85°C; Voltage: 10V; RoHS: TRUE; Device Class L3: Ceramic Capacitors; ComponentLink2Description: Datasheet; Voltage Rating: 10V; Package: C0805C-DG; Temperature Characteristic: X5R; Category: Cap
C335 C364 C369 = CMP-2008-04556-2: as C1271 on sheet Server_CPU_Sub_Power_Supplies; Octopart: https://octopart.com/grm155r61a105ke15d-murata-197442; Lead Free: Yes; ComponentLink2Description: Datasheet; Temperature: -55°C to +85°C; Temperature Range High: +85°C; Height: 0.55mm; Capacitance: 1uF; Ipc Land Pattern Name: CAPC10050X50; ComponentLink2URL: https://search.murata.co.jp/Ceramy/image/img/A01X/G101/ENG/GRM155R61A105KE15-01A.pdf; Temperature Range Low: -55°C; Device Class L2: Capacitors; Voltage Rating: 10V; RoHS: TRUE; Device Class L1: Passive Components; Device Class L3: Ceramic Capacitors; Temperature Characteristic: X5R; Mouser Description: 0402 1 uF 10 V ±10% Tolerance X5R Surface Mount Multilayer Ceramic Capacitor; Automotive: No; Package: GRM15-0.1; Digikey Description: CAP CER 1UF 10V X5R 0402; Value: 1uF; Category: Cap
C336 C341 C342 C344 C347-C358 C360-C363 C365-C368 = CMP-2100-03641-2: as C1274 on sheet Server_CPU_Sub_Power_Supplies; RoHS: TRUE; Temperature Characteristic: X7R; Octopart: https://octopart.com/grm155r71c104ka88d-murata-196880; Digikey Description: CAP CER 0.1UF 16V X7R 0402; Device Class L3: Ceramic Capacitors; Height: 0.55mm; ComponentLink2Description: Datasheet; Temperature Range Low: -55°C; Ipc Land Pattern Name: CAPC10050X219; ComponentLink2URL: https://search.murata.co.jp/Ceramy/image/img/A01X/G101/ENG/GRM155R71H471KA01-01A.pdf; Device Class L1: Passive Components; Lead Free: yes; Category: Cap; Package: GRM15; Temperature: -55°C to +125°C; Device Class L2: Capacitors; Temperature Range High: +125°C; Mouser Description: 0402 0.1 uF 16V ±10 % Tolerance X7R SMT Multilayer Ceramic Capacitor
C337 C338 = CMP-2008-04561-4: as C1307 on sheet Server_CPU_Sub_Power_Supplies; Max Operating Temperature: 85 degC; Package Quantity: 1; RoHSCompliant: true; Height: 0.5 mm; Mounting Technology: Surface Mount; Case Code (Metric): 1005; ComponentLink2URL: http://search.murata.co.jp/Ceramy/image/img/A01X/G101/ENG/GRM155R61A224KE19-01.pdf; Case Code (Imperial): 0402; Length: 1 mm; Radiation Hardening: No; Tolerance: 10%; Pins: 2; ComponentLink1Description: Manufacturer URL; Voltage Rating (DC): 10 V; Width: 0.5 mm; REACH SVHC: No SVHC; ComponentLink1URL: http://www.murata.com/; Min Operating Temperature: -55 degC; DatasheetVersion: 03/2016; Mount: Surface Mount; PackageReference: 0402; Packaging: Tape and Reel; ComponentLink2Description: Datasheet; PackageDescription: 2-Pin Surface Mount Device, Body 1 x 0.5 mm
C343 C345 = CMP-2008-04622-5: Chip Multilayer Ceramic Capacitors for General Purpose, 0402, 22000pF, X7R, 15%, 10%, 25V; Voltage: 25V; Capacitance: 22nF; Voltage Rating: 25V; Height: 0.5mm; Thickness: 0.022inch; Depth: 0.5mm; Voltage Rating (DC): 25V; Package Quantity: 1; Lead Free: Lead Free; Tolerance: 10%; Length: 1mm; Max Operating Temperature: 125°C; Termination: SMD/SMT; Case/Package: 0402; Radiation Hardening: No; REACH SVHC: No SVHC; Case Code (Imperial): 0402; Case Code (Metric): 1005; Packaging: Tape and Reel; Mount: Surface Mount; Width: 0.02inch; Min Operating Temperature: -55°C; Dielectric: X7R
C370 C371 = CMP-2008-03288-2: CAP CER 18PF 50V 5% NP0 0402; Manufacturer Part Number: C0402C180J5GACTU; Manufacturer: Kemet; Temperature Coefficient: 15%; Temperature Characteristic: C0G; Tolerance: 0.05; Material: Ceramic; Ipc Land Pattern Name: CAPC10050X50; Capacitance: 18 pF; Category: Cap; RoHS: TRUE; Automotive: No; Temperature Range High: +125°C; Height: 0.55mm; ComponentLink2Description: Datasheet; Lead Free: Yes; Value: 18 pF; Device Class L3: Ceramic Capacitors; Device Class L1: Passive Components; Digikey Description: CAP CER 18PF 50V 5% NP0 0402; Device Class L2: Capacitors; Voltage Rating: 50 V; ComponentLink2URL: https://content.kemet.com/datasheets/KEM_C1002_X7R_SMD.pdf; Octopart: https://octopart.com/c0402c180j5gactu-kemet-9138803; Mouser Description: Multilayer Ceramic Capacitors MLCC - SMD/SMT 50volts 18pF C0G 5%; Temperature: -55°C to +125°C; Temperature Range Low: -55°C; Package: C0402-BB
FB1 FB2 = CMP-0686-00602-4: Chip Ferrite Bead, 0603, 120Ω @ 100MHz, 25%, 0.025Ω, 3A; DC Resistance (DCR): 25mR; Shielding: Unshielded; Material: Steel; Number of Circuits: 1; Impedance: 120R; Tolerance: 25%; REACH SVHC: No SVHC; Case/Package: 0603; Max DC Current: 3A; Core Material: Ferrite; Case Code (Metric): 1608; Frequency: 100MHz; Package Quantity: 1; Height: 0.8mm; Lead Free: Lead Free; Test Frequency: 100MHz; RoHS Compliant: Yes; DC Resistance-Max: 25mR; Min Operating Temperature: -55°C; Width: 0.8mm; Termination: SMD/SMT; Length: 1.6mm; Max Current Rating: 3A; Number of Lines: 1; Series: BLM18S; Number of Pins: 2; Packaging: Tape and Reel; Current Rating: 3A; Depth: 0.8mm; Case Code (Imperial): 0603; Max Operating Temperature: 125°C
IC1 = LS1043ASN8QQB: Integrated Circuit; Manufacturer_Name: NXP; Datasheet Link: http://www.nxp.com/secured/assets/documents/en/data-sheet/LS1088A.pdf; Height: 2.61mm; Manufacturer_Part_Number: LS1043ASN8QQB; Mouser Part Number: 771-LS1043ASN8QQB; Mouser Price/Stock: https://www.mouser.co.uk/ProductDetail/NXP-Semiconductors/LS1043ASN8QQB/?qs=AQlKX63v8RsTATOTx7X0Jg%3D%3D
IC25 = DS125DF111SQE: Integrated Circuit; Manufacturer_Name: Texas Instruments; Datasheet Link: https://www.ti.com/lit/ds/symlink/ds125df111.pdf?ts=1617455597484; Height: 0.8mm; Manufacturer_Part_Number: DS125DF111SQE; Mouser Part Number: 595-DS125DF111SQE; Mouser Price/Stock: https://www.mouser.co.uk/ProductDetail/Texas-Instruments/DS125DF111SQE?qs=%252BFzhjShcsaLIb8%252B%252Bca5DzA%3D%3D; Arrow Part Number: DS125DF111SQE; Arrow Price/Stock: https://www.arrow.com/en/products/ds125df111sqe/texas-instruments
IC26 = PCA9554ABS,118: Integrated Circuit; Manufacturer_Name: NXP; Datasheet Link: http://www.nxp.com/docs/en/data-sheet/PCA9554_9554A.pdf; Height: 1mm; Manufacturer_Part_Number: PCA9554ABS,118; Mouser Part Number: 771-PCA9554ABS-T; Mouser Price/Stock: https://www.mouser.co.uk/ProductDetail/NXP-Semiconductors/PCA9554ABS118/?qs=LOCUfHb8d9vaWzBkYZLPtA%3D%3D; Arrow Part Number: PCA9554ABS,118; Arrow Price/Stock: https://www.arrow.com/en/products/pca9554abs118/nxp-semiconductors
IC27 = PCA9546AD,112: Integrated Circuit; Manufacturer_Name: Nexperia; Datasheet Link: http://docs-emea.rs-online.com/webdocs/0424/0900766b804242cd.pdf; Height: 1.75mm; Manufacturer_Part_Number: PCA9546AD,112; Arrow Part Number: PCA9546AD,112; Arrow Price/Stock: https://www.arrow.com/en/products/pca9546ad112/nxp-semiconductors
IC28 = AT24C04C-SSHM-T: Integrated Circuit; Manufacturer_Name: Microchip; Datasheet Link: https://datasheet.lcsc.com/szlcsc/Microchip-Tech-AT24C04C-SSHM-T_C6205.pdf; Height: 1.75mm; Manufacturer_Part_Number: AT24C04C-SSHM-T; Mouser Part Number: 556-AT24C04C-SSHM-T; Mouser Price/Stock: https://www.mouser.co.uk/ProductDetail/Microchip-Technology-Atmel/AT24C04C-SSHM-T?qs=rNaVQffb%252BtcPg4SMgvVriA%3D%3D; Arrow Part Number: AT24C04C-SSHM-T; Arrow Price/Stock: https://www.arrow.com/en/products/at24c04c-sshm-t/microchip-technology
IC29 = 9FG430AGLFT: Integrated Circuit; Manufacturer_Name: IDT; Datasheet Link: https://www.idt.com/document/dst/9fg430-datasheet; Height: 1.2mm; Manufacturer_Part_Number: 9FG430AGLFT
J4 = 2227023-1: Connector Accessories 1 Port SFP Cage Press Fit Right Angle Through Hole Nickel Tray; MF: {'manufacturer': u'TE Connectivity'}; Price: None; Value: *; Availability: Unavailable; Package: None; MP: 2227023-1
J5 = 1759503-1: mini PCI-E 8H Type I PKG G/F; MF: {'manufacturer': u'TE Connectivity'}; MP: 1759503-1; Value: *; Price: None; Availability: Unavailable; Package: None
L16 L17 = CMP-0227-00471-1: SMD Power Inductor WE-PD2, L = 180 µH; Inductance: 180 ÂµH; PackageDescription: SMD Inductor, 2-Leads, Body 7.8 x 7.0 mm; ComponentLink2Description: Datasheet; ComponentLink1URL: http://www.we-online.com; PackageVersion: 2004; ComponentLink1Description: Manufacturer Link; DatasheetVersion: ver 1, Oct-2004; PackageReference: WE-PD2-L; ComponentLink2URL: http://www.we-online.de/katalog/media/pdf/744775218.pdf
P5 = CMP-1676-00001-5: Male Header, Pitch 2.54 mm, 1 x 3 Position, Height 8.38 mm, Tail Length 3.18 mm, RoHS, Bulk; Manufacturer: Molex; Rows: 1; Voltage Rating: 250 V; Current Rating: 4 A; Min Operating Temperature: 0 degC; Lead Pitch: 0.1 inch; Packaging: Bulk; Contact Finish: Gold; RoHSCompliant: true; Contact Material: Brass; PackageReference: 22-28-4033; REACH SVHC: Unknown; PackageDescription: Male Header, Pitch 2.54 mm, 1 x 3 Position, Height 8.38 mm, Tail Length 3.18 mm; ComponentLink2URL: http://www.molex.com/pdm_docs/sd/022284033_sd.pdf; Height: 8.38 mm; Mounting Technology: Through Hole; ComponentLink1Description: Manufacturer URL; Length: 7.62 mm; Mount: Through Hole; DatasheetVersion: Rev. G, 01/2012; Max Operating Temperature: 75 degC; ComponentLink2Description: Datasheet; Colour: Black; Pins: 3; Contact Plating: Gold; Package Quantity: 1; ComponentLink1URL: http://www.molex.com/
R196-R199 R202 R203 R219 R227 = CMP-1011-00557-2: Part Number: ERJ2RKF2701X; Manufacturer: Panasonic
R200 R204 = CMP-2002-08135-2: RES SMD 10K OHM 1% 1/16W 0402; Power Rating: 63mW; Resistance: 10kR; Voltage Rating: 50V; Temperature Coefficient: 100ppm/°C; Case Code (Metric): 1005; Features: Automotive AEC-Q200; Termination: SMD/SMT; Mount: Surface Mount; Package Quantity: 10; Packaging: Tape and Reel; Case Code (Imperial): 0402; Weight: 2.3E-05oz; Lead Free: Lead Free; Width: 0.02inch; Max Power Dissipation: 63mW; Tolerance: 1%; Number of Terminations: 2; Height: 0.35mm; Number of Pins: 2; Composition: Thick Film; Length: 1mm; Voltage Rating (DC): 50V; Case/Package: 0402; Radiation Hardening: No; Contact Plating: Tin; Depth: 0.5mm; Military Standard: Not; Min Operating Temperature: -55°C; Max Operating Temperature: 155°C
R201 R205-R208 = CMP-2002-08276-2: RES Thick Film, 1kΩ, 1%, 0.063W, 100ppm/°C, 0402; Resistance: 1kR; Power Rating: 63mW; Voltage Rating (DC): 50V; Package Quantity: 10; Termination: SMD/SMT; Width: 0.5mm; Military Standard: Not; Length: 1mm; Contact Plating: Tin; Mount: Surface Mount; Packaging: Tape and Reel; Case Code (Imperial): 0402; Tolerance: 1%; Weight: 2.3E-05oz; Number of Pins: 2; Case/Package: 0402; Case Code (Metric): 1005; Lead Free: Lead Free; Number of Terminations: 2; Max Power Dissipation: 63mW; Depth: 0.5mm; Temperature Coefficient: 100ppm/°C; Max Operating Temperature: 155°C; Height: 0.35mm; Features: Automotive AEC-Q200; Composition: Thick Film; Radiation Hardening: No; Voltage Rating: 50V; Min Operating Temperature: -55°C
R209-R218 = CMP-2002-01154-4: Chip Resistor, 4.7 KOhm, +/- 1%, 0.1 W, -55 to 155 degC, 0402 (1005 Metric), RoHS, Tape and Reel; PartNumber: ERJ-2RKF4701X; Voltage Rating: 50 V; Case\/Package: 0402; Power Rating: 100 mW; Height: 0.35 mm; Mounting Technology: Surface Mount; REACH SVHC: Yes; Resistance: 4.7 KOhm; Max Operating Temperature: 155 degC; ComponentLink1Description: Manufacturer URL; ComponentLink2Description: Datasheet; Pins: 2; PackageReference: 0402; Tolerance: 1%; Case Code (Imperial): 0402; Length: 1 mm; PackageDescription: 2-Pin Surface Mount Device, Body 1 x 0.5 mm; RoHSCompliant: true; Package Quantity: 1; Radiation Hardening: No; DatasheetVersion: 04/2015; Width: 0.5 mm; Case Code (Metric): 1005; Mount: Surface Mount; ComponentLink1URL: http://www.panasonic.com/; Min Operating Temperature: -55 degC; Packaging: Cut Tape; ComponentLink2URL: http://industrial.panasonic.com/cdbs/www-data/pdf/RDA0000/AOA0000C86.pdf
R220-R222 = CMP-2002-00432-1: Manufacturer: Panasonic; Part Number: ERJ-2GEJ102X
R223 R226 R231 R235 R236 R238 = CMP-2000-07588-1: as R748-R751 on sheet Server_CPU_Sub_Power_Supplies; RoHSCompliant: True; Lead Free: LeadFree; Package Quantity: 1; Contact Plating: Tin; Length: 1mm; Radiation Hardening: No; REACH SVHC: NoSVHC; Max Operating Temperature: 155degC; Depth: 0.5mm; Case Code (Imperial): 0402; Military Standard: Not; Package Description: 2-Pin Surface Mount Device, Body 1 x 0.5 mm; Termination: SMD/SMT; Case Code (Metric): 1005; Height: 0.35mm; Packaging: TapeandReel; Voltage Rating (DC): 50V; Package Reference: 402; Number of Pins: 2; Tolerance: 1%; Mounting Technology: SurfaceMount; Width: 0.02inch; Mount: SurfaceMount; Datasheet URL: https://industrial.panasonic.com/cdbs/www-data/pdf/RDA0000/AOA0000C304.pdf; Composition: ThickFilm; Datasheet Version: 02/2017; Manufacturer URL: http://www.panasonic.com/; Max Power Dissipation: 100mW; Number of Terminations: 2; Min Operating Temperature: -55degC
R224 R225 = CMP-2001-04896-1: Manufacturer: Vishay Dale; Part Number: CRCW08050000Z0EA
R228 R230 = CMP-1011-00429-3: RES Thick Film, 200Ω, 1%, 0.063W, 100ppm/°C, 0402; Max Power Dissipation: 63mW; Voltage Rating: 50V; Resistance: 200R; Termination: SMD/SMT; Weight: 2.3E-05oz; Case/Package: 0402; Contact Plating: Tin; Number of Pins: 2; Width: 0.5mm; Height: 0.35mm; Case Code (Metric): 1005; Military Standard: Not; Features: Automotive AEC-Q200; Power Rating: 63mW; Temperature Coefficient: 100ppm/°C; Tolerance: 1%; Lead Free: Lead Free; Depth: 0.5mm; Max Operating Temperature: 155°C; Min Operating Temperature: -55°C; Package Quantity: 10; Voltage Rating (DC): 50V; Composition: Thick Film; Mount: Surface Mount; Radiation Hardening: No; Length: 1mm; Packaging: Tape and Reel; Number of Terminations: 2; Case Code (Imperial): 0402
R229 = CMP-2002-00965-1: Manufacturer: Panasonic; Part Number: ERJ-2RKF4990X
R232-R234 R237 R239-R241 = CMP-2002-08532-1: Part Number: CRCW040233R2FKED; Manufacturer: Vishay Dale
R242-R247 = CMP-1011-00363-3: RES Thick Film, 49.9Ω, 1%, 0.063W, 100ppm/°C, 0402; Resistance: 49.9R; Voltage Rating: 50V; Power Rating: 63mW; Temperature Coefficient: 100ppm/°C; Packaging: Tape and Reel; Height: 0.35mm; Length: 1mm; Case Code (Metric): 1005; Weight: 2.3E-05oz; Case Code (Imperial): 0402; Voltage Rating (DC): 50V; Composition: Thick Film; Lead Free: Lead Free; Package Quantity: 10; Number of Terminations: 2; Width: 0.5mm; Max Operating Temperature: 155°C; Depth: 0.5mm; Max Power Dissipation: 63mW; Tolerance: 1%; Radiation Hardening: No; Features: Automotive AEC-Q200; Min Operating Temperature: -55°C; Contact Plating: Tin; Mount: Surface Mount; Military Standard: Not; Termination: SMD/SMT; Case/Package: 0402
R248 = CMP-2000-03377-2: RES Thick Film, 475Ω, 1%, 0.1W, 100ppm/°C, 0603; Voltage Rating (DC): 75V; Power Rating: 100mW; Resistance: 475R; Termination: SMD/SMT; Weight: 7.1E-05oz; Case Code (Imperial): 0603; Tolerance: 1%; Case/Package: 0603; Length: 1.55mm; Case Code (Metric): 1608; Packaging: Tape and Reel; Max Operating Temperature: 155°C; Width: 0.033inch; Temperature Coefficient: 100ppm/°C; Contact Plating: Tin; Composition: Thick Film; Voltage Rating: 75V; Number of Terminations: 2; Depth: 0.85mm; Lead Free: Lead Free; Height: 0.45mm; Features: Automotive AEC-Q200; Package Quantity: 10; Military Standard: Not; Max Power Dissipation: 100mW; Radiation Hardening: No; Min Operating Temperature: -55°C; Mount: Surface Mount
Y3 = AK2PAF1-156.2500: XTAL OSC XO 156.25MHZ 3.3V LVPEC.   MANUFACTURER: ABRACON; MF: {'manufacturer': u'Abracon LLC'}; Package: None; MP: AK2PAF1-156.2500; Availability: Unavailable; Price: None; Value: *
Y4 = CMP-0277-00001-1: Crystal, SMD, 25.000000MHz Stab=50ppm 18.0pF; Manufacturer: Abracon; Packing Type: Tape & Reel; Body Shape: Rectangular; Case Size: 5.0 x 3.2 mm; PackageDescription: 4-Pin SMT Crystal, 5.2 x 3.4 mm Body; ComponentLink2Description: Datasheet; Mounting Technology: Surface Mount; ComponentLink1URL: http://www.abracon.com/; PackageReference: ABM3B; DatasheetVersion: Apr-13; PartNumber: ABM3B-25.000MHZ-B2-T; ComponentLink2URL: http://www.abracon.com/Resonators/abm3b.pdf; ComponentLink1Description: Manufacturer URL; Storage Temperature: -40 to 80 degC